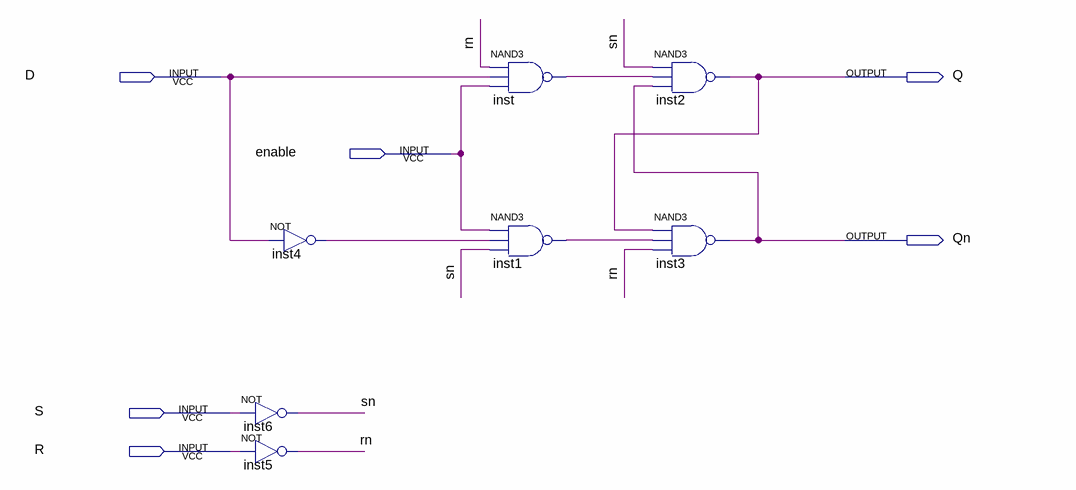
[diagram p0: schematic sheet]
// Quartus schematic latchDSR.bdf as structural Verilog: 7 symbols, 6 pins
module latchDSR (
  input  D,
  input  enable,
  input  S,
  input  R,
  output Q,
  output Qn
);

  wire inst1_out, inst4_out, inst_out, rn, sn;

  not inst4 (inst4_out, D);
  not inst6 (sn, S);
  not inst5 (rn, R);
  nand inst (inst_out, rn, D, enable);
  nand inst1 (inst1_out, enable, inst4_out, sn);
  nand inst2 (Q, sn, inst_out, Qn);
  nand inst3 (Qn, Q, inst1_out, rn);
endmodule
